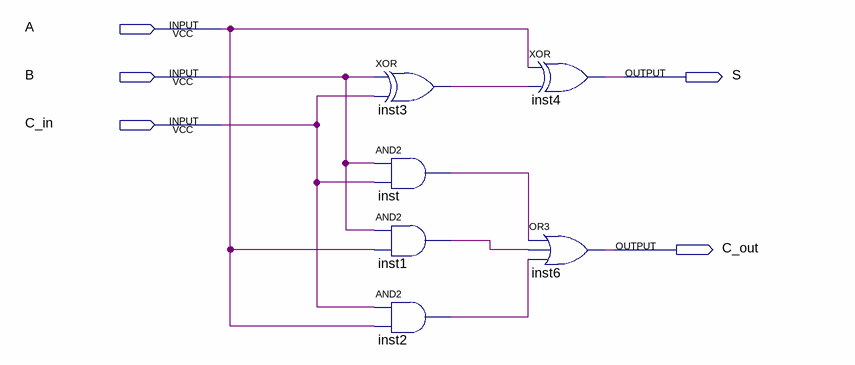
[diagram p0: schematic sheet]
// Quartus schematic Bloques_Full_Adder.bdf as structural Verilog: 6 symbols, 5 pins
module Bloques_Full_Adder (
  input  A,
  input  B,
  input  C_in,
  output S,
  output C_out
);

  wire inst1_out, inst2_out, inst3_out, inst_out;

  xor inst3 (inst3_out, B, C_in);
  and inst (inst_out, B, C_in);
  and inst1 (inst1_out, B, A);
  and inst2 (inst2_out, C_in, A);
  xor inst4 (S, A, inst3_out);
  or inst6 (C_out, inst_out, inst1_out, inst2_out);
endmodule
